# EAGLE design buck1 (EAGLE 9.3.0)
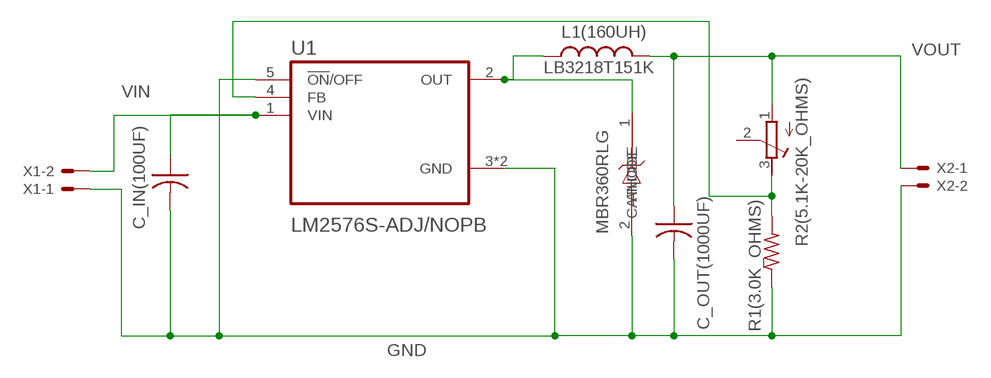
[diagram p0: schematic, sheet 1]

## Parts
C_IN(100UF)  C-USC1206  [C1206]
C_OUT(1000UF)  C-USC1206  [C1206]
CR1  MBR360RLG  [DO-201AD_ONS]
L1(160UH)  LB3218T151K  [INDC3218X200N]
R1(3.0K_OHMS)  R-US_R1206  [R1206]
R2(5.1K-20K_OHMS)  R-TRIMMTS63Z  [RTRIMTS63Z]
U1  LM2576S-ADJ/NOPB  [VREG_TPS79625KTTR]
X1  22-23-2021  [22-23-2021]
X2  22-23-2021  [22-23-2021]

## Nets
GND: C_IN(100UF).2 C_OUT(1000UF).2 CR1.2(ANODE) R1(3.0K_OHMS).1 U1.3(GND) U1.5(!ON!/OFF) U1.6(GND) X1.1 X2.2
N$3: CR1.1(CATHODE) L1(160UH).1 U1.2(OUT)
N$4: R1(3.0K_OHMS).2 R2(5.1K-20K_OHMS).3(E) U1.4(FB)
VIN: C_IN(100UF).1 U1.1(VIN) X1.2
VOUT: C_OUT(1000UF).1 L1(160UH).2 R2(5.1K-20K_OHMS).1(A) X2.1
Unconnected: R2(5.1K-20K_OHMS).2(S)

## Library data of the parts
C_IN(100UF) C_OUT(1000UF) = rcl:C-US: CAPACITOR, American symbol; SPICEPREFIX: C
CR1 = MBR360RLG:MBR360RLG; BUILT_BY: EMA_UL_Team; MANUFACTURER_PART_NUMBER: MBR360RLG; VENDOR: ON Semiconductor
L1(160UH) = LB3218T151K:LB3218T151K: FIXED IND 150UH 105MA 3.2 OHM; DESCRIPTION: Inductor Chip Wirewound 150uH 10% 796KHz Ferrite 105mA 4.16Ohm DCR 1207 T/R; DIGI-KEY_PART_NUMBER: 587-3081-1-ND; MF: Taiyo Yuden; MP: LB3218T151K; PACKAGE: 3218 Taiyo Yuden; PURCHASE-URL: https://pricing.snapeda.com/search/part/LB3218T151K/?ref=eda
R1(3.0K_OHMS) = rcl:R-US_: RESISTOR, American symbol; SPICEPREFIX: 3.0k
R2(5.1K-20K_OHMS) = rcl:R-TRIMM: Trimm resistor; SPICEMODEL: X; SPICEPREFIXL: POT
U1 = LM2576S-ADJ_NOPB:LM2576S-ADJ/NOPB; DESCRIPTION: SIMPLE SWITCHER&reg; 40V, 3A Low Component Count Step-Down Regulator 5-DDPAK/TO-263 -40 to 125; DIGI-KEY_PART_NUMBER: LM2576S-ADJ/NOPB-ND; MF: Texas Instruments; MP: LM2576S-ADJ/NOPB; PACKAGE: TO-263-5 Texas Instruments; PURCHASE-URL: https://pricing.snapeda.com/search/part/LM2576S-ADJ/NOPB/?ref=eda
X1 X2 = con-molex:22-23-2021: .100" (2.54mm) Center Header - 2 Pin; MF: MOLEX; MPN: 22-23-2021; OC_FARNELL: 1462926; OC_NEWARK: 25C3832

## Board
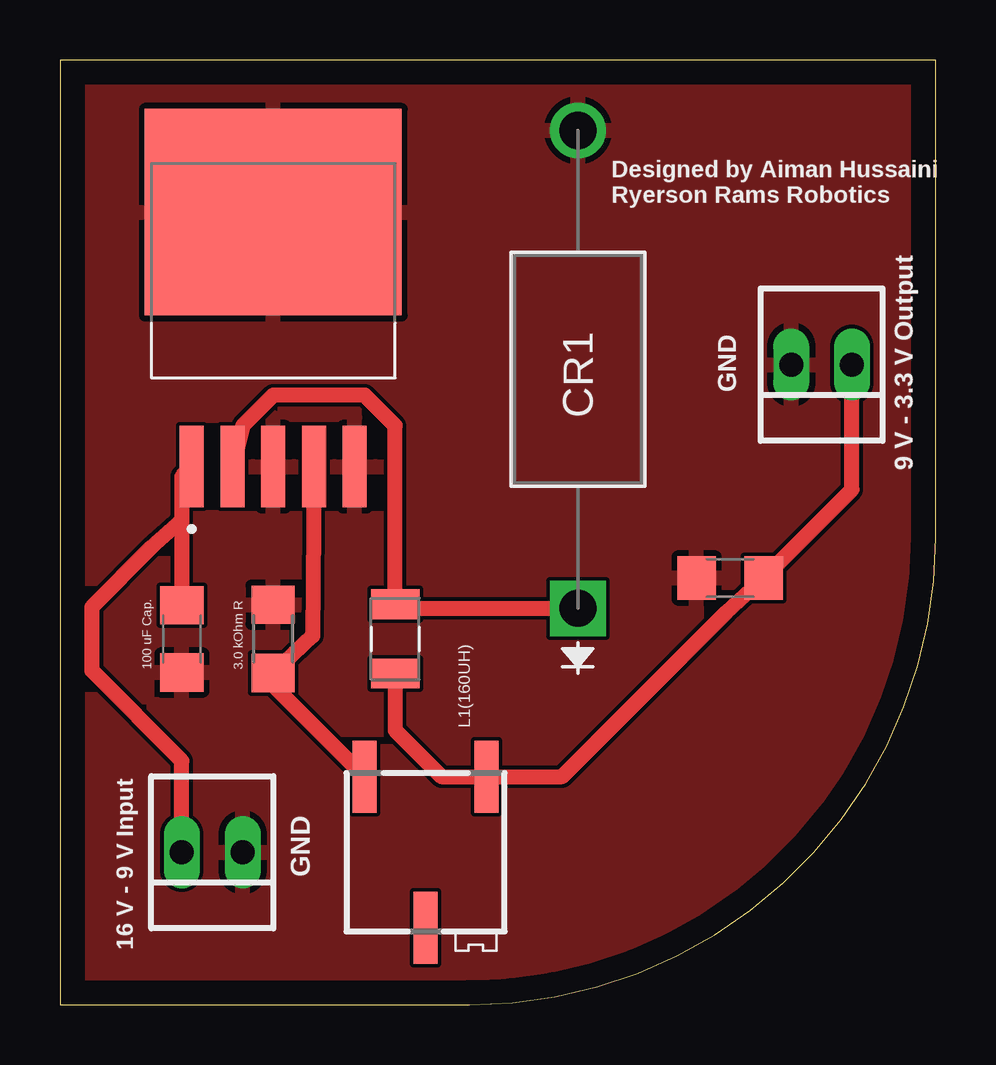
[diagram p1: board, top side]
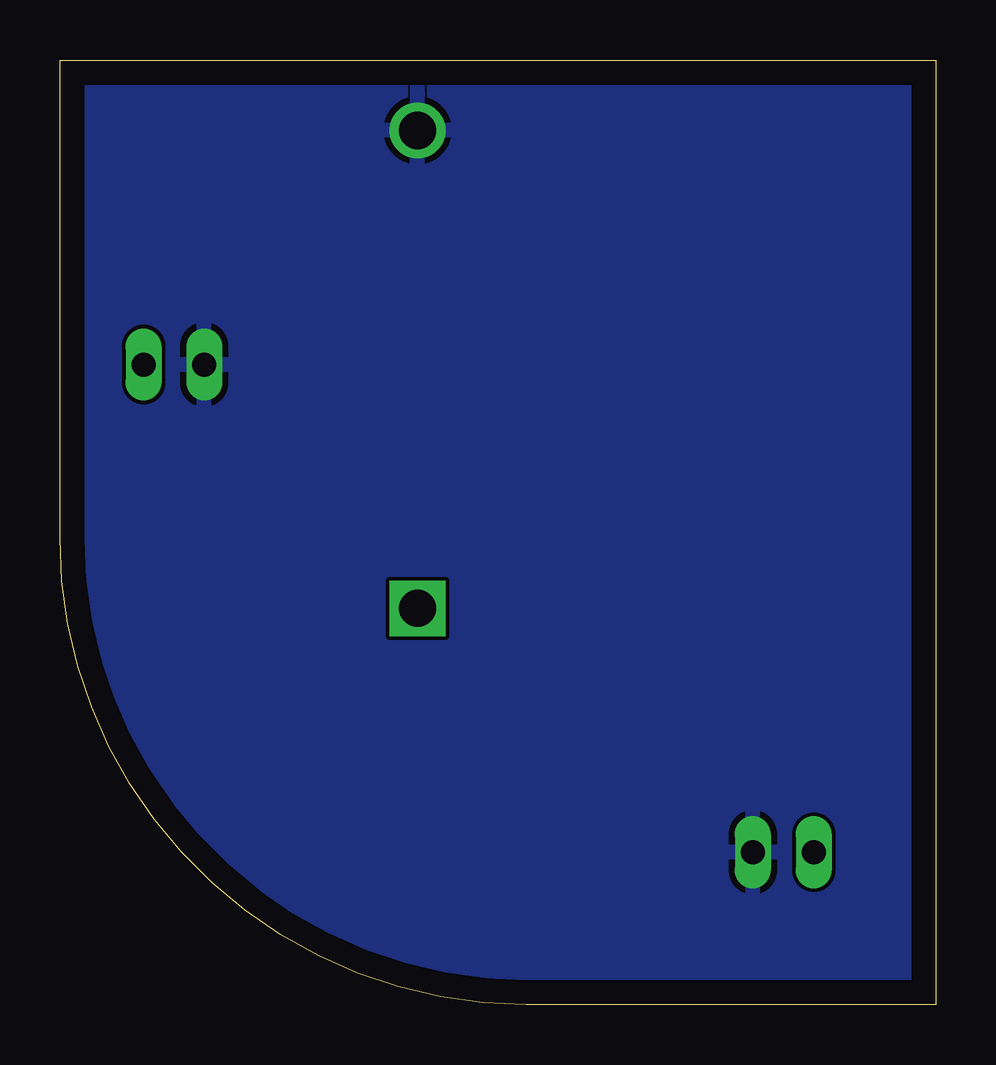
[diagram p2: board, bottom side, seen from below]

Size 36.5 x 39.36 mm. Coordinates in mm from the lower left corner, seen from the top.
Outline: 0,0 17.06,0 arc90 36.5,19.44 36.5,39.36 0,39.36 0,0
Copper layers (1*16): Top 0.035mm / dielectric 1.5mm / Bottom 0.035mm
Design rules "default": minimum track width 6mil, minimum drill 0.35mm, track to track 6mil, track to pad 6mil, pad to pad 6mil, via to via 6mil, smd to smd 6mil, copper to edge 40mil, drill to drill 6mil, minimum pad ring 10mil, minimum via ring 8mil, stop-mask expansion 4mil, vias tented up to drill 0mil, thermal gap 10mil

### Footprints (pad centres in the part's own frame; a part is rotated, then mirrored left to right if it is on the bottom)
C1206 = smd 1.6 x 1.8: 1 -1.4,0; 2 1.4,0
DO-201AD_ONS = drill 1.549 pad 2.057 square: 1 0,0 | drill 1.549 pad 2.057: 2 19.914,0
INDC3218X200N = smd 1.24 x 2.02: 1 -1.44,0; 2 1.44,0
R1206 = smd 1.6 x 1.803: 1 -1.422,0; 2 1.422,0
RTRIMTS63Z = smd 1 x 3: 1 -2.55,-3.15; 2 0,3.15; 3 2.55,-3.15
VREG_TPS79625KTTR = smd 3.4 x 1: 1 -10.6,3.4; 2 -10.6,1.7; 3 -10.6,0; 4 -10.6,-1.7; 5 -10.6,-3.4 | smd 8.6 x 10.7: 6 0,0
22-23-2021 = drill 1 long: 1 -1.27,0; 2 1.27,0

### Placement (x,y rotation side)
C_IN(100UF)  5.08,15.24 270 top
C_OUT(1000UF)  27.94,17.78 180 top
CR1  21.59,16.51 90 top
L1(160UH)  13.97,15.24 270 top
R1(3.0K_OHMS)  8.89,15.24 270 top
R2(5.1K-20K_OHMS)  15.24,6.35 180 top
U1  8.89,33.02 90 top
X1  6.35,6.35 180 top
X2  31.75,26.67 180 top

### Tracks (layer width: path | path; a pad name or v marks a point on that pad's centre or on a via)
GND
  pour Top: 0,39.37 36.83,39.37 36.83,19.46 arc-90 17.37,0 0,0
  pour Bottom: 0,39.37 36.83,39.37 36.83,19.05 arc-90 17.78,0 0,0
N$3
  Top 0.635: CR1.1 14.14,16.51 L1(160UH).1 13.97,24.13 12.7,25.4 8.89,25.4 7.62,24.13 U1.2
N$4
  Top 0.635: R2(5.1K-20K_OHMS).3 8.89,13.3 R1(3.0K_OHMS).2 10.54,15.37 10.56,17.53 U1.4
VIN
  Top 0.635: U1.1 5.08,22.01 5.08,20.19 | 5.08,20.19 C_IN(100UF).1 | X1.2 5.08,10.16 1.33,13.91 1.33,16.57 3.81,19.05 5.08,20.19
VOUT
  Top 0.635: R2(5.1K-20K_OHMS).1 | L1(160UH).2 13.97,11.43 15.9,9.5 R2(5.1K-20K_OHMS).1 | R2(5.1K-20K_OHMS).1 20.93,9.5 27.81,16.38 C_OUT(1000UF).1 33.02,21.46 X2.1

### Text on the board
tNames: Designed by Aiman Hussaini / Ryerson Rams Robotics | 9 V - 3.3 V Output | GND | 100 uF Cap. | 3.0 kOhm R | GND | 16 V - 9 V Input